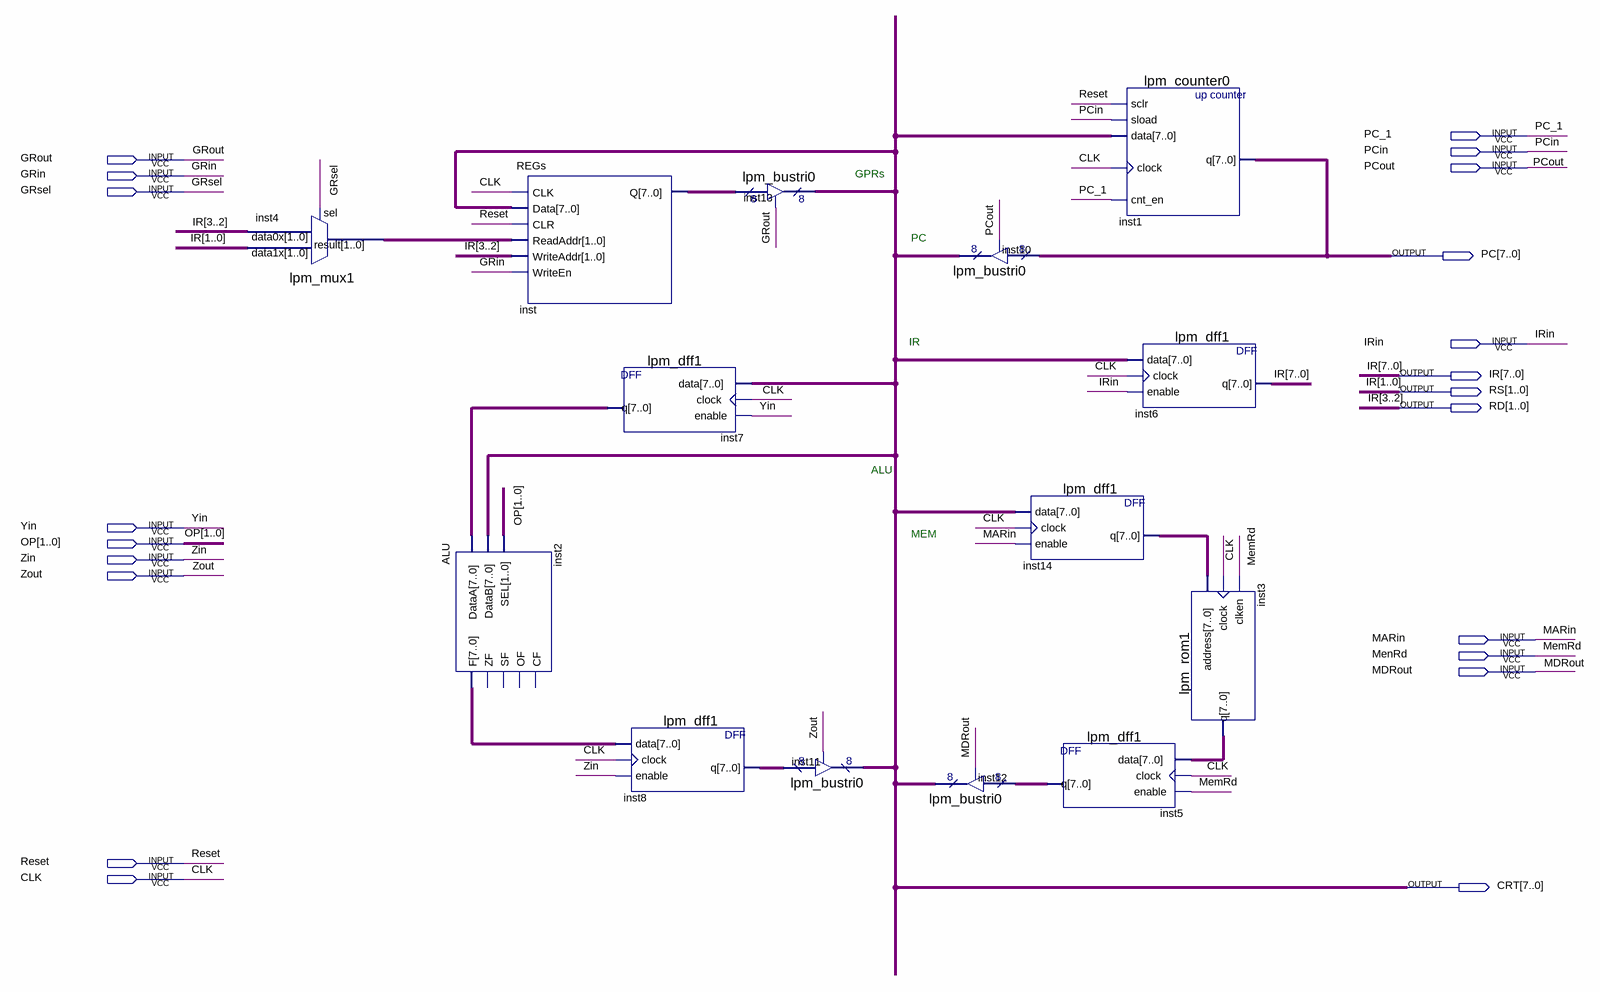
[diagram p0: schematic sheet]
// Quartus schematic DataPath.bdf as structural Verilog: 14 symbols, 21 pins
module DataPath (
  input  PC_1,
  input  PCin,
  input  GRout,
  input  PCout,
  input  GRin,
  input  GRsel,
  input  IRin,
  input  Yin,
  input  [1:0] OP,
  input  Zin,
  input  Zout,
  input  MARin,
  input  MenRd,
  input  MDRout,
  input  Reset,
  input  CLK,
  output [7:0] PC,
  output [7:0] IR,
  output [1:0] RS,
  output [1:0] RD,
  output [7:0] CRT
);

  wire [1:0] inst4_result;
  wire [7:0] inst2_f, inst3_q, inst5_q, inst7_q, inst8_q, inst14_q, inst_q;

  lpm_mux1 inst4 (.data1x(IR[1:0]), .data0x(IR[3:2]), .sel(GRsel), .result(inst4_result));
  ALU inst2 (.DataA(inst7_q), .DataB(CRT), .SEL(OP), .F(inst2_f));  // open: ZF, SF, OF, CF
  REGs inst (
    .CLK(CLK), .Data(CRT), .CLR(Reset), .ReadAddr(inst4_result), .WriteAddr(IR[3:2]), .WriteEn(GRin),
    .Q(inst_q));
  lpm_dff1 inst7 (.data(CRT), .clock(CLK), .enable(Yin), .q(inst7_q));
  lpm_dff1 inst8 (.data(inst2_f), .clock(CLK), .enable(Zin), .q(inst8_q));
  lpm_bustri0 inst13 (.enabledt(GRout), .data(inst_q), .tridata(CRT));
  lpm_bustri0 inst11 (.enabledt(Zout), .data(inst8_q), .tridata(CRT));
  lpm_bustri0 inst12 (.enabledt(MDRout), .data(inst5_q), .tridata(CRT));
  lpm_bustri0 inst10 (.enabledt(PCout), .data(PC), .tridata(CRT));
  lpm_dff1 inst14 (.data(CRT), .clock(CLK), .enable(MARin), .q(inst14_q));
  lpm_dff1 inst5 (.data(inst3_q), .clock(CLK), .enable(MenRd), .q(inst5_q));
  lpm_counter0 inst1 (.sclr(Reset), .sload(PCin), .data(CRT), .clock(CLK), .cnt_en(PC_1), .q(PC));
  lpm_dff1 inst6 (.data(CRT), .clock(CLK), .enable(IRin), .q(IR));
  lpm_rom1 inst3 (.address(inst14_q), .clock(CLK), .clken(MenRd), .q(inst3_q));

  assign RD = IR[3:2];
  assign RS = IR[1:0];

  // Other names for the same wires on the sheet: MemRd = MenRd

  // Notes on the sheet:
  //   GPRs
  //   PC
  //   IR
  //   ALU
  //   MEM
endmodule
